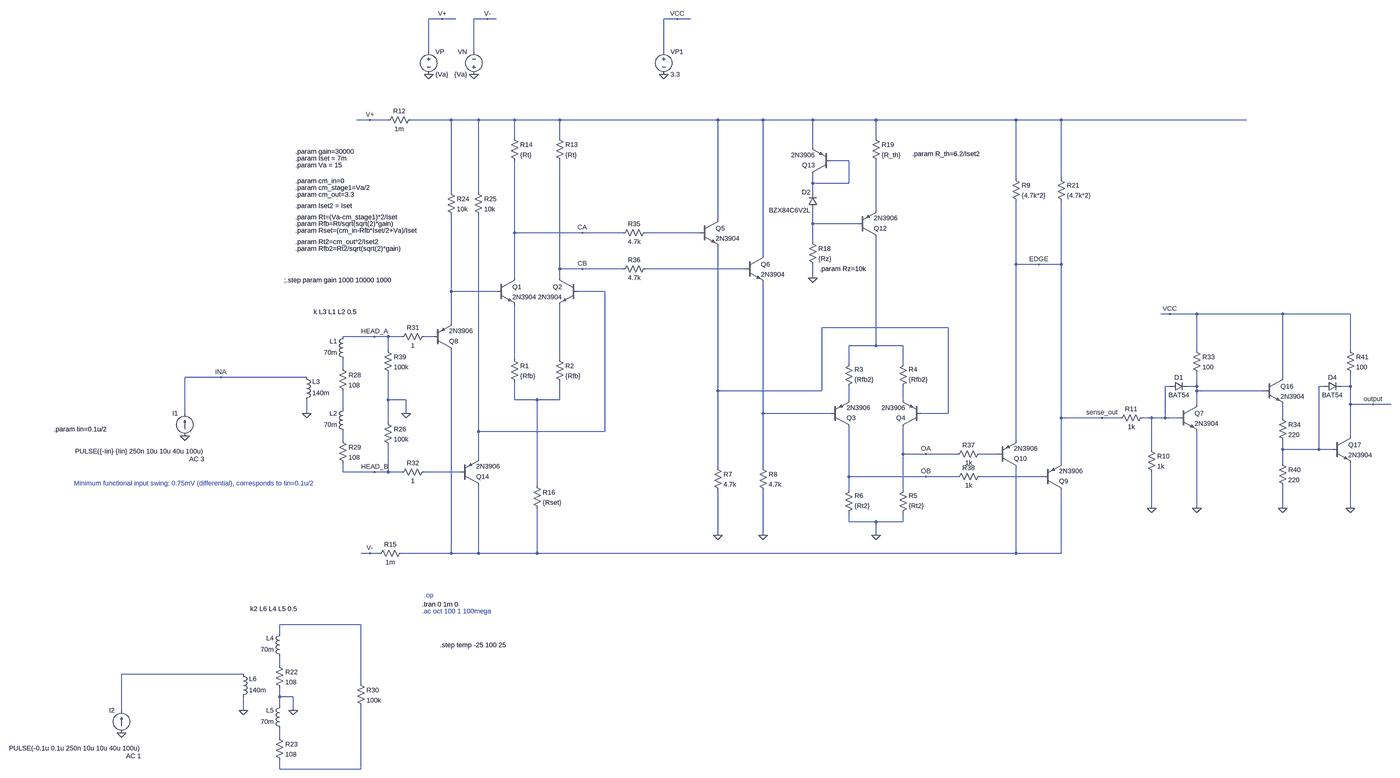
[diagram p0: schematic tape_sense_amp1.asc, whole sheet]
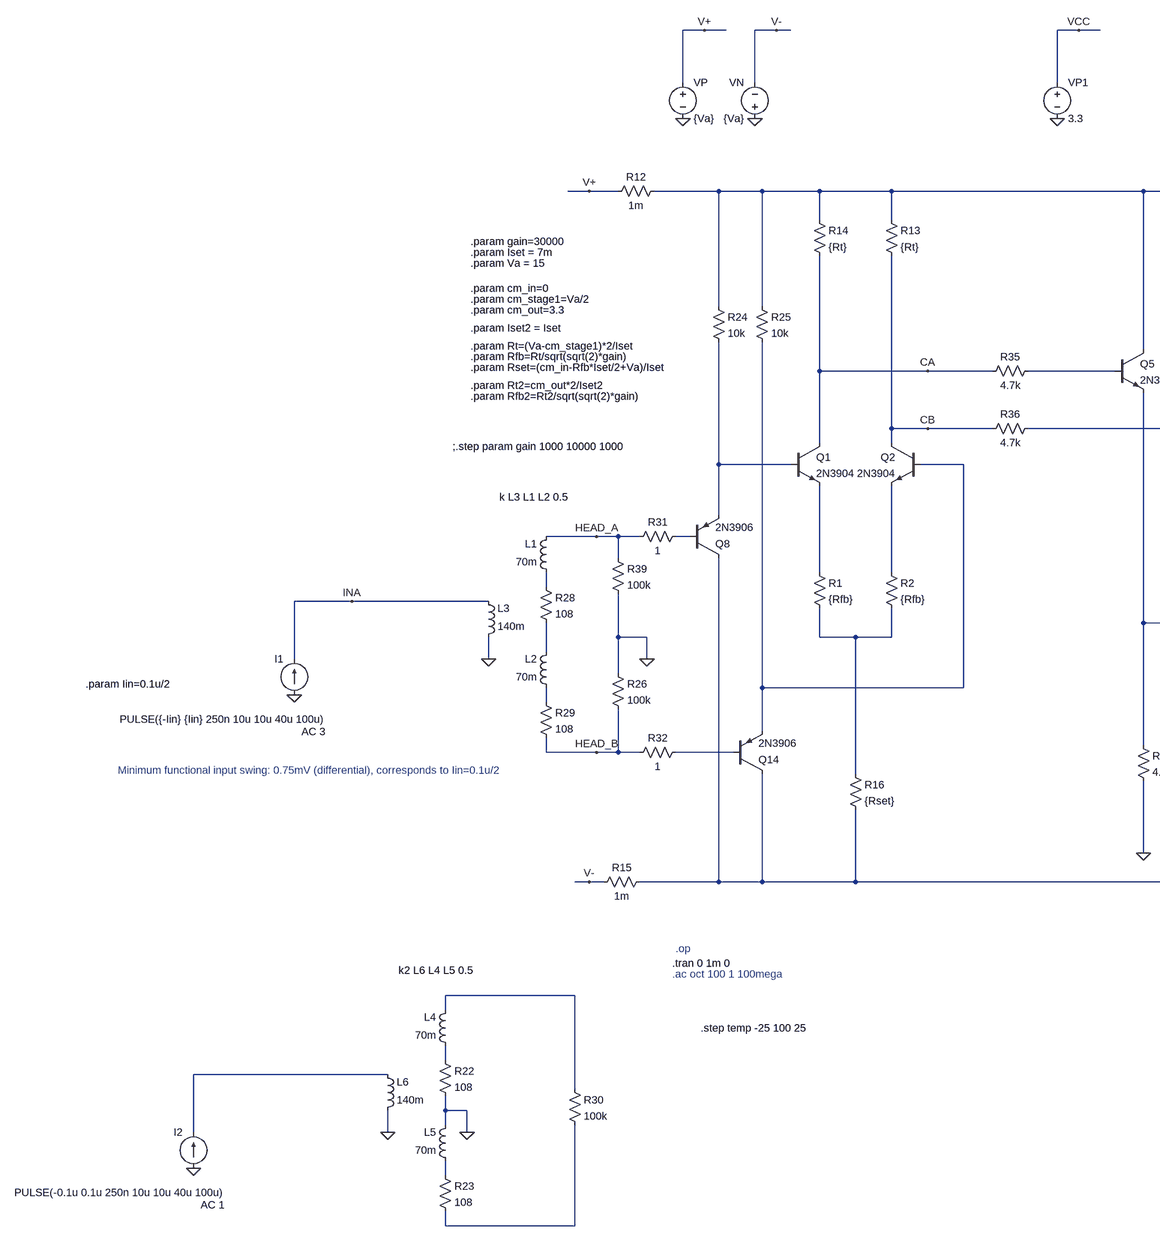
[diagram p1: schematic tape_sense_amp1.asc, part, row 1 of 1, column 1 of 2]
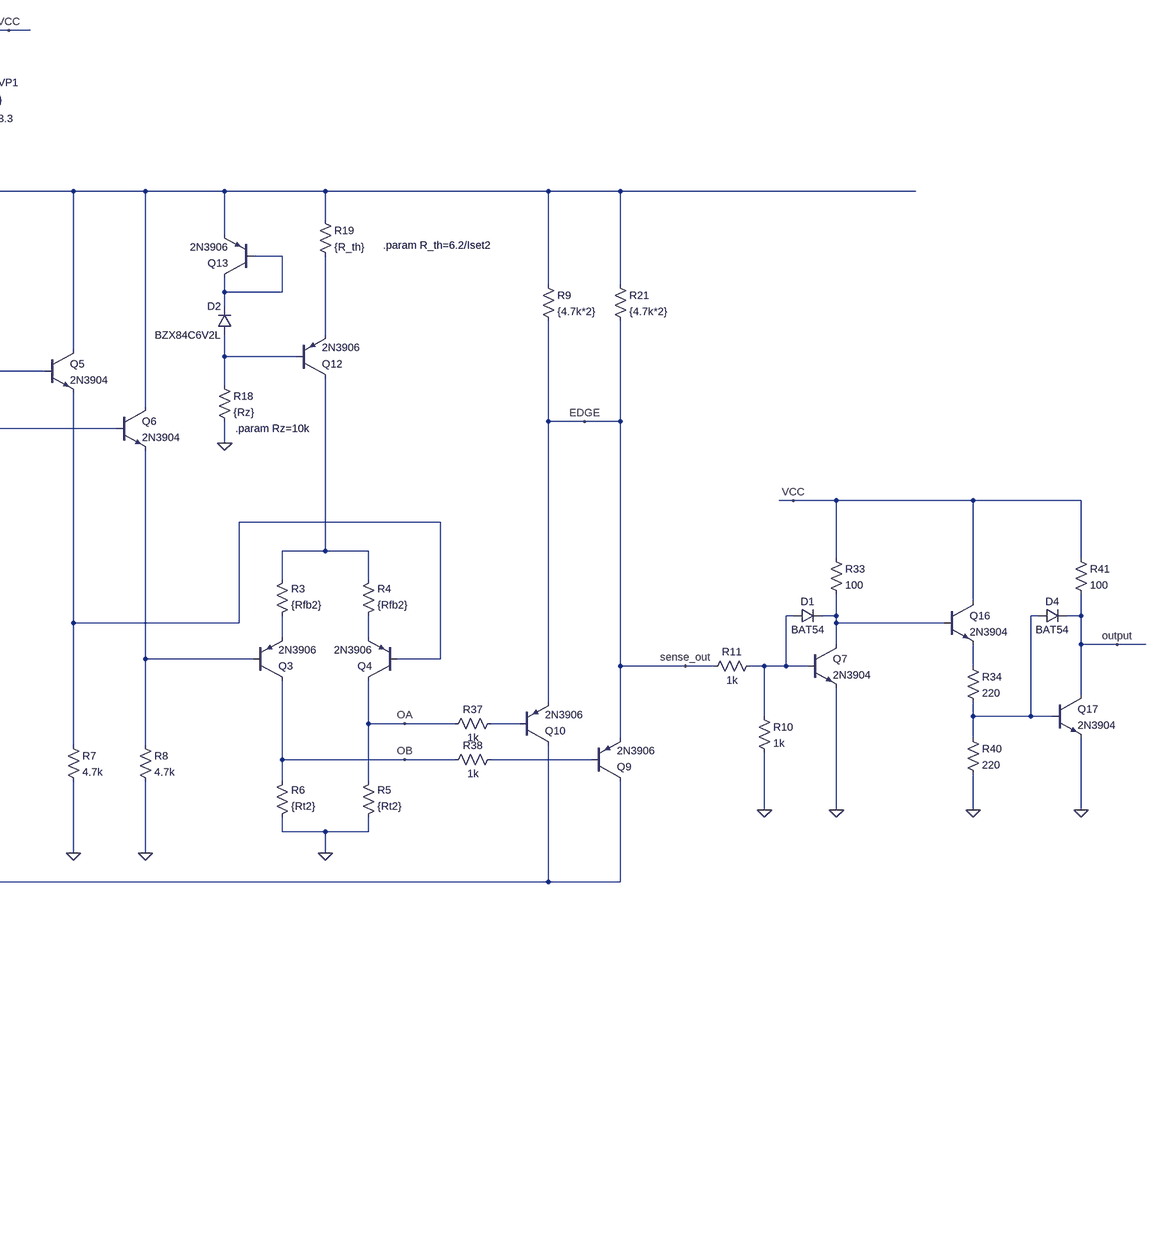
[diagram p2: schematic tape_sense_amp1.asc, part, row 1 of 1, column 2 of 2]
tape_sense_amp1.asc, the LTspice schematic file:
Version 4.1
SHEET 1 4868 2048
WIRE -224 -1328 -272 -1328
WIRE -176 -1328 -224 -1328
WIRE -64 -1328 -112 -1328
WIRE -32 -1328 -64 -1328
WIRE 608 -1328 560 -1328
WIRE 656 -1328 608 -1328
WIRE -272 -1200 -272 -1328
WIRE -112 -1200 -112 -1328
WIRE 560 -1200 560 -1328
WIRE -480 -800 -528 -800
WIRE -416 -800 -480 -800
WIRE -192 -800 -336 -800
WIRE -96 -800 -192 -800
WIRE 32 -800 -96 -800
WIRE 192 -800 32 -800
WIRE 752 -800 192 -800
WIRE 912 -800 752 -800
WIRE 1088 -800 912 -800
WIRE 1312 -800 1088 -800
WIRE 1808 -800 1312 -800
WIRE 1968 -800 1808 -800
WIRE 2624 -800 1968 -800
WIRE 32 -736 32 -800
WIRE 192 -736 192 -800
WIRE 1312 -736 1312 -800
WIRE 1088 -704 1088 -800
WIRE 1216 -656 1152 -656
WIRE 1808 -592 1808 -800
WIRE 1968 -592 1968 -800
WIRE 1088 -576 1088 -608
WIRE 1216 -576 1216 -656
WIRE 1216 -576 1088 -576
WIRE -192 -544 -192 -800
WIRE -96 -544 -96 -800
WIRE 1088 -544 1088 -576
WIRE 1312 -480 1312 -656
WIRE 752 -448 752 -800
WIRE 1088 -432 1088 -480
WIRE 1248 -432 1088 -432
WIRE 32 -400 32 -656
WIRE 272 -400 32 -400
WIRE 416 -400 272 -400
WIRE 688 -400 496 -400
WIRE 1088 -368 1088 -432
WIRE 912 -320 912 -800
WIRE 1808 -288 1808 -512
WIRE 1888 -288 1808 -288
WIRE 1968 -288 1968 -512
WIRE 1968 -288 1888 -288
WIRE 192 -272 192 -656
WIRE 272 -272 192 -272
WIRE 416 -272 272 -272
WIRE 848 -272 496 -272
WIRE 32 -240 32 -400
WIRE 192 -240 192 -272
WIRE 1088 -240 1088 -288
WIRE -192 -192 -192 -464
WIRE -32 -192 -192 -192
WIRE 352 -192 256 -192
WIRE 2352 -112 2320 -112
WIRE 2448 -112 2352 -112
WIRE 2752 -112 2448 -112
WIRE 2992 -112 2752 -112
WIRE -192 -80 -192 -192
WIRE 1568 -64 1120 -64
WIRE -464 -32 -576 -32
WIRE -416 -32 -464 -32
WIRE -368 -32 -416 -32
WIRE -256 -32 -288 -32
WIRE 1312 0 1312 -384
WIRE 1312 0 1216 0
WIRE 1408 0 1312 0
WIRE -416 16 -416 -32
WIRE 2448 16 2448 -112
WIRE 2992 16 2992 -112
WIRE 32 48 32 -144
WIRE 192 48 192 -144
WIRE 1216 64 1216 0
WIRE 1408 64 1408 0
WIRE -576 80 -576 48
WIRE -1008 112 -1136 112
WIRE -704 112 -1008 112
WIRE 2752 112 2752 -112
WIRE 2352 144 2336 144
WIRE 2448 144 2448 96
WIRE 2448 144 2416 144
WIRE 2896 144 2880 144
WIRE 2992 144 2992 96
WIRE 2992 144 2960 144
WIRE 752 160 752 -352
WIRE 1120 160 1120 -64
WIRE 1120 160 752 160
WIRE 2448 160 2448 144
WIRE 2688 160 2448 160
WIRE -416 192 -416 96
WIRE -352 192 -416 192
WIRE 32 192 32 128
WIRE 112 192 32 192
WIRE 192 192 192 128
WIRE 192 192 112 192
WIRE 1216 192 1216 144
WIRE 1408 192 1408 144
WIRE 2448 208 2448 160
WIRE 2992 208 2992 144
WIRE 3072 208 2992 208
WIRE 3136 208 3072 208
WIRE -576 224 -576 160
WIRE -1136 240 -1136 112
WIRE -704 240 -704 192
WIRE -352 240 -352 192
WIRE 912 240 912 -224
WIRE 1152 240 912 240
WIRE 1568 240 1568 -64
WIRE 1568 240 1472 240
WIRE 1968 256 1968 -288
WIRE 2112 256 1968 256
WIRE 2176 256 2112 256
WIRE 2288 256 2256 256
WIRE 2336 256 2336 144
WIRE 2336 256 2288 256
WIRE 2384 256 2336 256
WIRE 2752 256 2752 208
WIRE -416 272 -416 192
WIRE -96 304 -96 -464
WIRE 352 304 352 -192
WIRE 352 304 -96 304
WIRE 2992 320 2992 208
WIRE -576 336 -576 304
WIRE 1808 336 1808 -288
WIRE 2288 368 2288 256
WIRE 2752 368 2752 336
WIRE 2880 368 2880 144
WIRE 2880 368 2752 368
WIRE 2928 368 2880 368
WIRE 1408 384 1408 288
WIRE 1488 384 1408 384
WIRE 1600 384 1488 384
WIRE 1744 384 1680 384
WIRE -96 400 -96 304
WIRE 1968 416 1968 256
WIRE 2752 416 2752 368
WIRE 752 432 752 160
WIRE 912 432 912 240
WIRE -576 448 -576 416
WIRE -464 448 -576 448
WIRE -416 448 -416 352
WIRE -416 448 -464 448
WIRE -368 448 -416 448
WIRE -160 448 -288 448
WIRE 1216 464 1216 288
WIRE 1488 464 1216 464
WIRE 1600 464 1488 464
WIRE 1904 464 1680 464
WIRE 112 496 112 192
WIRE 1216 512 1216 464
WIRE 1408 512 1408 384
WIRE 2288 576 2288 448
WIRE 2448 576 2448 304
WIRE 2752 576 2752 496
WIRE 2992 576 2992 416
WIRE 1216 624 1216 592
WIRE 1312 624 1216 624
WIRE 1408 624 1408 592
WIRE 1408 624 1312 624
WIRE 752 672 752 512
WIRE 912 672 912 512
WIRE 1312 672 1312 624
WIRE -480 736 -512 736
WIRE -448 736 -480 736
WIRE -192 736 -192 16
WIRE -192 736 -368 736
WIRE -96 736 -96 496
WIRE -96 736 -192 736
WIRE 112 736 112 576
WIRE 112 736 -96 736
WIRE 1808 736 1808 432
WIRE 1808 736 112 736
WIRE 1968 736 1968 512
WIRE 1968 736 1808 736
WIRE -512 992 -800 992
WIRE -800 1024 -800 992
WIRE -800 1136 -800 1104
WIRE -928 1168 -1360 1168
WIRE -512 1200 -512 992
WIRE -800 1248 -800 1216
WIRE -752 1248 -800 1248
WIRE -800 1280 -800 1248
WIRE -1360 1296 -1360 1168
WIRE -928 1296 -928 1248
WIRE -752 1296 -752 1248
WIRE -800 1392 -800 1360
WIRE -800 1504 -800 1472
WIRE -512 1504 -512 1280
WIRE -512 1504 -800 1504
FLAG -1008 112 INA
FLAG -480 -800 V+
FLAG -480 736 V-
FLAG -272 -1120 0
FLAG -112 -1120 0
FLAG -224 -1328 V+
FLAG -64 -1328 V-
FLAG 560 -1120 0
FLAG 608 -1328 VCC
FLAG 272 -400 CA
FLAG 272 -272 CB
FLAG 1488 464 OB
FLAG 1488 384 OA
FLAG 1312 672 0
FLAG 752 672 0
FLAG 912 672 0
FLAG 1088 -240 0
FLAG -1136 320 0
FLAG -704 240 0
FLAG -1360 1376 0
FLAG -752 1296 0
FLAG -928 1296 0
FLAG -464 -32 HEAD_A
FLAG -464 448 HEAD_B
FLAG 1888 -288 EDGE
FLAG -352 240 0
FLAG 2112 256 sense_out
FLAG 2448 576 0
FLAG 2352 -112 VCC
FLAG 3072 208 output
FLAG 2992 576 0
FLAG 2752 576 0
FLAG 2288 576 0
SYMBOL npn -32 -240 R0
SYMATTR InstName Q1
SYMATTR Value 2N3904
SYMBOL res 16 32 R0
SYMATTR InstName R1
SYMATTR Value {Rfb}
SYMBOL res 176 32 R0
SYMATTR InstName R2
SYMATTR Value {Rfb}
SYMBOL npn 256 -240 M0
SYMATTR InstName Q2
SYMATTR Value 2N3904
SYMBOL res 176 -752 R0
SYMATTR InstName R13
SYMATTR Value {Rt}
SYMBOL res 16 -752 R0
SYMATTR InstName R14
SYMATTR Value {Rt}
SYMBOL voltage -272 -1216 R0
SYMATTR InstName VP
SYMATTR Value {Va}
SYMBOL voltage -112 -1104 R180
WINDOW 0 24 96 Left 2
WINDOW 3 24 16 Left 2
SYMATTR InstName VN
SYMATTR Value {Va}
SYMBOL voltage 560 -1216 R0
SYMATTR InstName VP1
SYMATTR Value 3.3
SYMBOL res 1200 160 M180
WINDOW 0 36 76 Left 2
WINDOW 3 36 40 Left 2
SYMATTR InstName R3
SYMATTR Value {Rfb2}
SYMBOL res 1392 160 M180
WINDOW 0 36 76 Left 2
WINDOW 3 36 40 Left 2
SYMATTR InstName R4
SYMATTR Value {Rfb2}
SYMBOL res 1392 608 M180
WINDOW 0 36 76 Left 2
WINDOW 3 36 40 Left 2
SYMATTR InstName R5
SYMATTR Value {Rt2}
SYMBOL res 1200 608 M180
WINDOW 0 36 76 Left 2
WINDOW 3 36 40 Left 2
SYMATTR InstName R6
SYMATTR Value {Rt2}
SYMBOL pnp 1152 288 M180
SYMATTR InstName Q3
SYMATTR Value 2N3906
SYMBOL pnp 1472 288 R180
SYMATTR InstName Q4
SYMATTR Value 2N3906
SYMBOL npn 688 -448 R0
SYMATTR InstName Q5
SYMATTR Value 2N3904
SYMBOL npn 848 -320 R0
SYMATTR InstName Q6
SYMATTR Value 2N3904
SYMBOL res 736 416 R0
SYMATTR InstName R7
SYMATTR Value 4.7k
SYMBOL res 896 416 R0
SYMATTR InstName R8
SYMATTR Value 4.7k
SYMBOL res 1792 -608 R0
SYMATTR InstName R9
SYMATTR Value {4.7k*2}
SYMBOL res -432 -784 R270
WINDOW 0 32 56 VTop 2
WINDOW 3 0 56 VBottom 2
SYMATTR InstName R12
SYMATTR Value 1m
SYMBOL res -352 720 R90
WINDOW 0 0 56 VBottom 2
WINDOW 3 32 56 VTop 2
SYMATTR InstName R15
SYMATTR Value 1m
SYMBOL res 96 480 R0
SYMATTR InstName R16
SYMATTR Value {Rset}
SYMBOL pnp 1248 -384 M180
SYMATTR InstName Q12
SYMATTR Value 2N3906
SYMBOL pnp 1152 -608 R180
SYMATTR InstName Q13
SYMATTR Value 2N3906
SYMBOL diode 1104 -480 R180
WINDOW 0 24 64 Left 2
WINDOW 3 24 0 Left 2
SYMATTR InstName D2
SYMATTR Value BZX84C6V2L
SYMBOL res 1072 -384 R0
SYMATTR InstName R18
SYMATTR Value {Rz}
SYMBOL res 1296 -752 R0
SYMATTR InstName R19
SYMATTR Value {R_th}
SYMBOL res 1952 -608 R0
SYMATTR InstName R21
SYMATTR Value {4.7k*2}
SYMBOL current -1136 320 R180
WINDOW 0 24 80 Left 2
WINDOW 3 -69 -54 Left 2
WINDOW 123 -69 -82 Left 2
WINDOW 39 0 0 Left 0
SYMATTR InstName I1
SYMATTR Value PULSE({-Iin} {Iin} 250n 10u 10u 40u 100u)
SYMATTR Value2 AC 3
SYMBOL ind -560 64 R180
WINDOW 0 36 80 Left 2
WINDOW 3 36 40 Left 2
SYMATTR InstName L1
SYMATTR Value 70m
SYMATTR Type ind
SYMBOL ind -560 320 R180
WINDOW 0 36 80 Left 2
WINDOW 3 36 40 Left 2
SYMATTR InstName L2
SYMATTR Value 70m
SYMATTR Type ind
SYMBOL res -592 64 R0
SYMATTR InstName R28
SYMATTR Value 108
SYMBOL res -592 320 R0
SYMATTR InstName R29
SYMATTR Value 108
SYMBOL ind -720 208 M180
WINDOW 0 36 80 Left 2
WINDOW 3 36 40 Left 2
SYMATTR InstName L3
SYMATTR Value 140m
SYMATTR Type ind
SYMBOL current -1360 1376 R180
WINDOW 0 24 80 Left 2
WINDOW 3 -69 -54 Left 2
WINDOW 123 -69 -82 Left 2
WINDOW 39 0 0 Left 0
SYMATTR InstName I2
SYMATTR Value PULSE(-0.1u 0.1u 250n 10u 10u 40u 100u)
SYMATTR Value2 AC 1
SYMBOL ind -784 1120 R180
WINDOW 0 36 80 Left 2
WINDOW 3 36 40 Left 2
SYMATTR InstName L4
SYMATTR Value 70m
SYMATTR Type ind
SYMBOL ind -784 1376 R180
WINDOW 0 36 80 Left 2
WINDOW 3 36 40 Left 2
SYMATTR InstName L5
SYMATTR Value 70m
SYMATTR Type ind
SYMBOL res -816 1120 R0
SYMATTR InstName R22
SYMATTR Value 108
SYMBOL res -816 1376 R0
SYMATTR InstName R23
SYMATTR Value 108
SYMBOL ind -944 1264 M180
WINDOW 0 36 80 Left 2
WINDOW 3 36 40 Left 2
SYMATTR InstName L6
SYMATTR Value 140m
SYMATTR Type ind
SYMBOL res -528 1184 R0
SYMATTR InstName R30
SYMATTR Value 100k
SYMBOL res -272 -48 R90
WINDOW 0 0 56 VBottom 2
WINDOW 3 32 56 VTop 2
SYMATTR InstName R31
SYMATTR Value 1
SYMBOL res -272 432 R90
WINDOW 0 0 56 VBottom 2
WINDOW 3 32 56 VTop 2
SYMATTR InstName R32
SYMATTR Value 1
SYMBOL res 2272 240 R90
WINDOW 0 0 56 VBottom 2
WINDOW 3 32 56 VTop 2
SYMATTR InstName R11
SYMATTR Value 1k
SYMBOL pnp 1744 432 M180
SYMATTR InstName Q10
SYMATTR Value 2N3906
SYMBOL pnp 1904 512 M180
SYMATTR InstName Q9
SYMATTR Value 2N3906
SYMBOL res 512 -416 R90
WINDOW 0 0 56 VBottom 2
WINDOW 3 32 56 VTop 2
SYMATTR InstName R35
SYMATTR Value 4.7k
SYMBOL res 512 -288 R90
WINDOW 0 0 56 VBottom 2
WINDOW 3 32 56 VTop 2
SYMATTR InstName R36
SYMATTR Value 4.7k
SYMBOL res 1696 368 R90
WINDOW 0 0 56 VBottom 2
WINDOW 3 32 56 VTop 2
SYMATTR InstName R37
SYMATTR Value 1k
SYMBOL res 1696 448 R90
WINDOW 0 0 56 VBottom 2
WINDOW 3 32 56 VTop 2
SYMATTR InstName R38
SYMATTR Value 1k
SYMBOL pnp -256 16 M180
SYMATTR InstName Q8
SYMATTR Value 2N3906
SYMBOL pnp -160 496 M180
SYMATTR InstName Q14
SYMATTR Value 2N3906
SYMBOL res -208 -560 R0
SYMATTR InstName R24
SYMATTR Value 10k
SYMBOL res -112 -560 R0
SYMATTR InstName R25
SYMATTR Value 10k
SYMBOL res -432 0 R0
SYMATTR InstName R39
SYMATTR Value 100k
SYMBOL res -432 256 R0
SYMATTR InstName R26
SYMATTR Value 100k
SYMBOL npn 2384 208 R0
SYMATTR InstName Q7
SYMATTR Value 2N3904
SYMBOL res 2432 0 R0
SYMATTR InstName R33
SYMATTR Value 100
SYMBOL diode 2352 160 R270
WINDOW 0 32 32 VTop 2
WINDOW 3 0 32 VBottom 2
SYMATTR InstName D1
SYMATTR Value BAT54
SYMBOL npn 2688 112 R0
SYMATTR InstName Q16
SYMATTR Value 2N3904
SYMBOL res 2736 240 R0
SYMATTR InstName R34
SYMATTR Value 220
SYMBOL res 2736 400 R0
SYMATTR InstName R40
SYMATTR Value 220
SYMBOL npn 2928 320 R0
SYMATTR InstName Q17
SYMATTR Value 2N3904
SYMBOL res 2976 0 R0
SYMATTR InstName R41
SYMATTR Value 100
SYMBOL diode 2896 160 R270
WINDOW 0 32 32 VTop 2
WINDOW 3 0 32 VBottom 2
SYMATTR InstName D4
SYMATTR Value BAT54
SYMBOL res 2272 352 R0
SYMATTR InstName R10
SYMATTR Value 1k
TEXT -232 1064 Left 2 !.step temp -25 100 25
TEXT -296 944 Left 2 ;.ac oct 100 1 100mega
TEXT -296 920 Left 2 !.tran 0 1m 0
TEXT 1440 -680 Left 2 !.param R_th=6.2/Iset2
TEXT -680 -120 Left 2 !k L3 L1 L2 0.5
TEXT -904 936 Left 2 !k2 L6 L4 L5 0.5
TEXT -1600 296 Left 2 !.param Iin=0.1u/2
TEXT -1528 488 Left 2 ;Minimum functional input swing: 0.75mV (differential), corresponds to Iin=0.1u/2
TEXT -744 -432 Left 2 !.param Rfb=Rt/sqrt(sqrt(2)*gain)
TEXT -744 -456 Left 2 !.param Rt=(Va-cm_stage1)*2/Iset
TEXT -744 -584 Left 2 !.param cm_in=0
TEXT -744 -496 Left 2 !.param Iset2 = Iset
TEXT -744 -368 Left 2 !.param Rt2=cm_out*2/Iset2
TEXT -744 -344 Left 2 !.param Rfb2=Rt2/sqrt(sqrt(2)*gain)
TEXT -744 -536 Left 2 !.param cm_out=3.3
TEXT -744 -560 Left 2 !.param cm_stage1=Va/2
TEXT -744 -408 Left 2 !.param Rset=(cm_in-Rfb*Iset/2+Va)/Iset
TEXT -744 -664 Left 2 !.param Iset = 7m
TEXT -744 -640 Left 2 !.param Va = 15
TEXT -744 -688 Left 2 !.param gain=30000
TEXT -288 888 Left 2 ;.op
TEXT 1112 -272 Left 2 !.param Rz=10k
TEXT -784 -232 Left 2 !;.step param gain 1000 10000 1000

The netlist it stands for:
* tape_sense_amp1.asc
Q1 CA N007 N012 0 2N3904
R1 N012 N018 {Rfb}
R2 N013 N018 {Rfb}
Q2 CB N008 N013 0 2N3904
R13 N001 CB {Rt}
R14 N001 CA {Rt}
VP V+ 0 {Va}
VN 0 V- {Va}
VP1 VCC 0 3.3
R3 N019 N011 {Rfb2}
R4 N020 N011 {Rfb2}
R5 0 OA {Rt2}
R6 0 OB {Rt2}
Q3 OB N022 N019 0 2N3906
Q4 OA N009 N020 0 2N3906
Q5 N001 N005 N009 0 2N3904
Q6 N001 N006 N022 0 2N3904
R7 N009 0 4.7k
R8 N022 0 4.7k
R9 N001 sense_out {4.7k*2}
R12 V+ N001 1m
R15 N028 V- 1m
R16 N018 N028 {Rset}
Q12 N011 N004 N003 0 2N3906
Q13 N002 N002 N001 0 2N3906
D2 N004 N002 BZX84C6V2L
R18 N004 0 {Rz}
R19 N001 N003 {R_th}
R21 N001 sense_out {4.7k*2}
I1 0 INA PULSE({-Iin} {Iin} 250n 10u 10u 40u 100u) AC 3
L1 N014 HEAD_A 70m
L2 N024 N021 70m
R28 N014 N021 108
R29 N024 HEAD_B 108
L3 0 INA 140m
I2 0 N031 PULSE(-0.1u 0.1u 250n 10u 10u 40u 100u) AC 1
L4 N030 N029 70m
L5 N032 0 70m
R22 N030 0 108
R23 N032 N033 108
L6 0 N031 140m
R30 N029 N033 100k
R31 N010 HEAD_A 1
R32 N026 HEAD_B 1
R11 N015 sense_out 1k
Q10 N028 N025 sense_out 0 2N3906
Q9 N028 N027 sense_out 0 2N3906
R35 N005 CA 4.7k
R36 N006 CB 4.7k
R37 N025 OA 1k
R38 N027 OB 1k
Q8 N028 N010 N007 0 2N3906
Q14 N028 N026 N008 0 2N3906
R24 N001 N007 10k
R25 N001 N008 10k
R39 HEAD_A 0 100k
R26 0 HEAD_B 100k
Q7 N016 N015 0 0 2N3904
R33 VCC N016 100
D1 N015 N016 BAT54
Q16 VCC N016 N023 0 2N3904
R34 N023 N017 220
R40 N017 0 220
Q17 output N017 0 0 2N3904
R41 VCC output 100
D4 N017 output BAT54
R10 N015 0 1k
.model D D
.lib standard.dio
.model NPN NPN
.model PNP PNP
.lib standard.bjt
.step temp -25 100 25
* .ac oct 100 1 100mega
.tran 0 1m 0
.param R_th=6.2/Iset2
k L3 L1 L2 0.5
k2 L6 L4 L5 0.5
.param Iin=0.1u/2
* Minimum functional input swing: 0.75mV (differential), corresponds to Iin=0.1u/2
.param Rfb=Rt/sqrt(sqrt(2)*gain)
.param Rt=(Va-cm_stage1)*2/Iset
.param cm_in=0
.param Iset2 = Iset
.param Rt2=cm_out*2/Iset2
.param Rfb2=Rt2/sqrt(sqrt(2)*gain)
.param cm_out=3.3
.param cm_stage1=Va/2
.param Rset=(cm_in-Rfb*Iset/2+Va)/Iset
.param Iset = 7m
.param Va = 15
.param gain=30000
* .op
.param Rz=10k
;.step param gain 1000 10000 1000
.backanno
.end